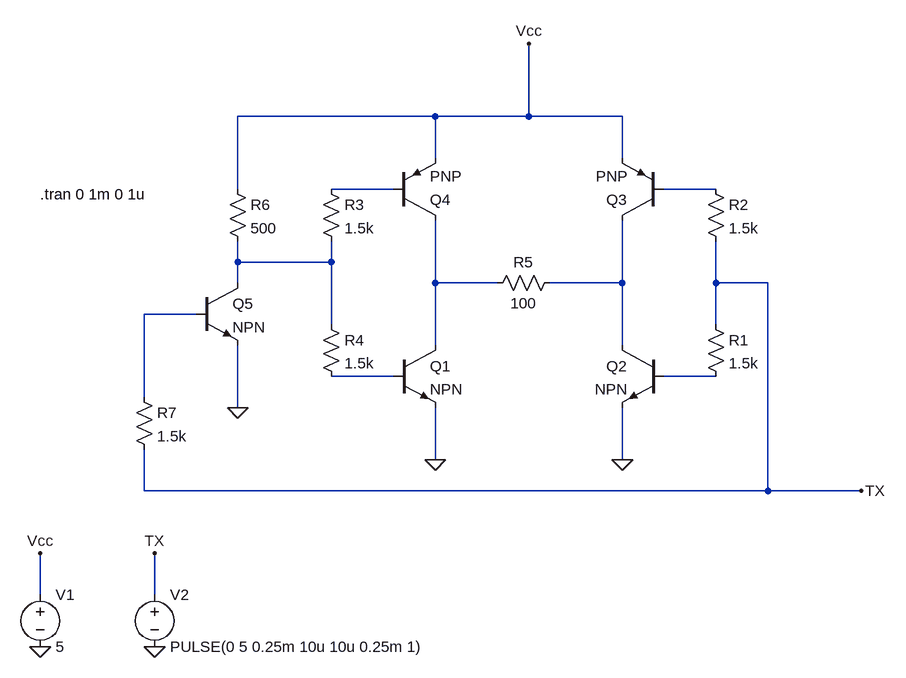
[diagram p0: schematic HbridgeTX.asc]
HbridgeTX.asc, the LTspice schematic file:
Version 4
SHEET 1 1004 896
WIRE 304 64 0 64
WIRE 448 64 448 -48
WIRE 448 64 304 64
WIRE 592 64 448 64
WIRE 304 128 304 64
WIRE 592 128 592 64
WIRE 0 176 0 64
WIRE 240 176 144 176
WIRE 736 176 656 176
WIRE 0 288 0 256
WIRE 144 288 144 256
WIRE 144 288 0 288
WIRE 0 320 0 288
WIRE 304 320 304 224
WIRE 400 320 304 320
WIRE 592 320 592 224
WIRE 592 320 480 320
WIRE 736 320 736 256
WIRE 816 320 736 320
WIRE -64 368 -144 368
WIRE 144 384 144 288
WIRE 736 384 736 320
WIRE 304 416 304 320
WIRE 592 416 592 320
WIRE 240 464 144 464
WIRE 736 464 656 464
WIRE -144 496 -144 368
WIRE 0 512 0 416
WIRE 304 592 304 512
WIRE 592 592 592 512
WIRE -144 640 -144 576
WIRE 816 640 816 320
WIRE 816 640 -144 640
WIRE 960 640 816 640
WIRE -304 800 -304 736
WIRE -128 800 -128 736
FLAG 592 592 0
FLAG 304 592 0
FLAG 0 512 0
FLAG -304 880 0
FLAG -128 880 0
FLAG -304 736 Vcc
FLAG 448 -48 Vcc
FLAG -128 736 TX
FLAG 960 640 TX
SYMBOL npn 240 416 R0
SYMATTR InstName Q1
SYMBOL npn 656 416 M0
SYMATTR InstName Q2
SYMBOL pnp 656 224 R180
SYMATTR InstName Q3
SYMBOL pnp 240 224 M180
SYMATTR InstName Q4
SYMBOL res 720 368 R0
SYMATTR InstName R1
SYMATTR Value 1.5k
SYMBOL res 720 160 R0
SYMATTR InstName R2
SYMATTR Value 1.5k
SYMBOL res 128 160 R0
SYMATTR InstName R3
SYMATTR Value 1.5k
SYMBOL res 128 368 R0
SYMATTR InstName R4
SYMATTR Value 1.5k
SYMBOL res 496 304 R90
WINDOW 0 0 56 VBottom 2
WINDOW 3 32 56 VTop 2
SYMATTR InstName R5
SYMATTR Value 100
SYMBOL res -16 160 R0
SYMATTR InstName R6
SYMATTR Value 500
SYMBOL npn -64 320 R0
SYMATTR InstName Q5
SYMBOL res -160 480 R0
SYMATTR InstName R7
SYMATTR Value 1.5k
SYMBOL voltage -304 784 R0
SYMATTR InstName V1
SYMATTR Value 5
SYMBOL voltage -128 784 R0
SYMATTR InstName V2
SYMATTR Value PULSE(0 5 0.25m 10u 10u 0.25m 1)
TEXT -304 184 Left 2 !.tran 0 1m 0 1u

The netlist it stands for:
* HbridgeTX.asc
Q1 N004 N007 0 0 NPN
Q2 N005 N008 0 0 NPN
Q3 N005 N002 Vcc 0 PNP
Q4 N004 N001 Vcc 0 PNP
R1 TX N008 1.5k
R2 N002 TX 1.5k
R3 N001 N003 1.5k
R4 N003 N007 1.5k
R5 N005 N004 100
R6 Vcc N003 500
Q5 N003 N006 0 0 NPN
R7 N006 TX 1.5k
V1 Vcc 0 5
V2 TX 0 PULSE(0 5 0.25m 10u 10u 0.25m 1)
.model NPN NPN
.model PNP PNP
.lib standard.bjt
.tran 0 1m 0 1u
.backanno
.end